# EAGLE board stm32_main_0_2 (EAGLE 5.10), part 1 of 2
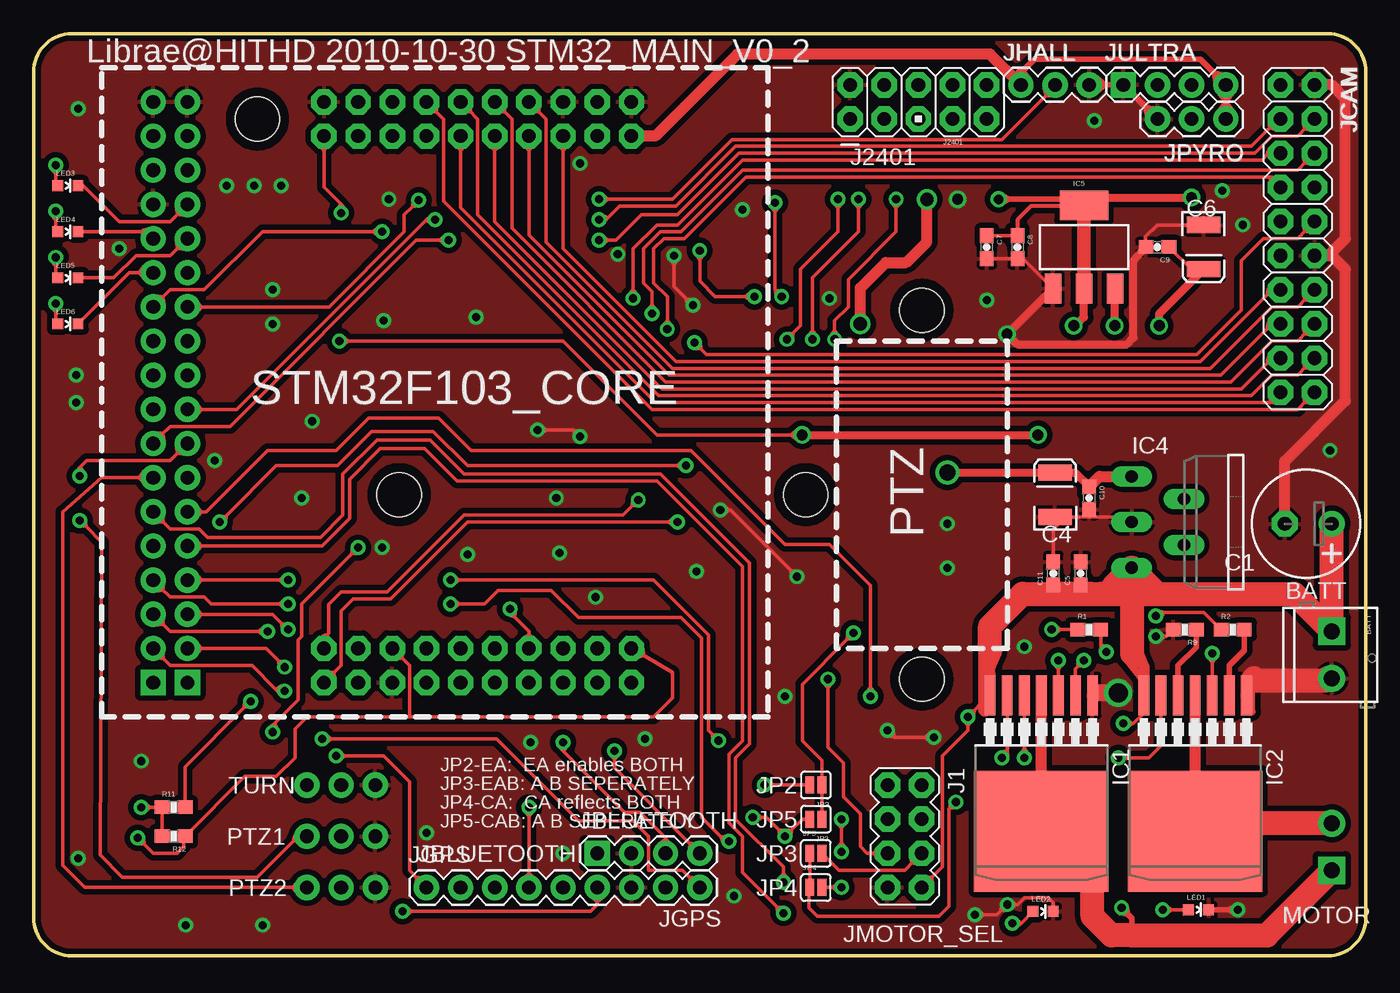
[diagram p1: board, top side]
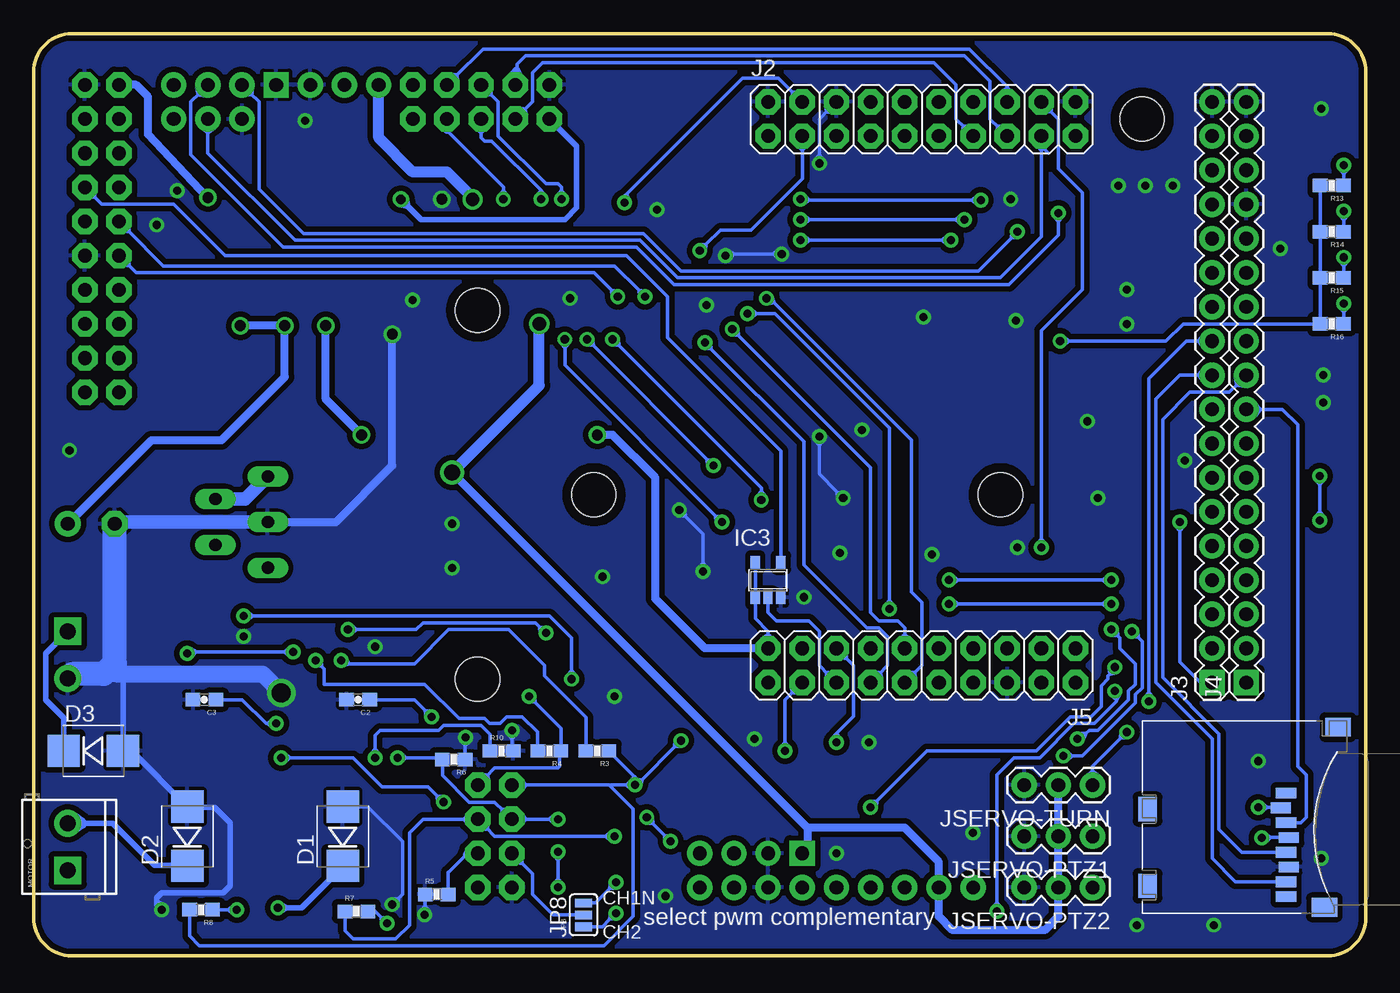
[diagram p2: board, bottom side, seen from below]

Size 99.06 x 68.58 mm. Coordinates in mm from the lower left corner, seen from the top.
Outline: 2.84,68.58 arc90 0,65.74 0,2.84 arc90 2.84,0 96.22,0 arc90 99.06,2.84 99.06,65.74 arc90 96.22,68.58 2.84,68.58
Copper layers (1*16): Top 0.035mm / dielectric 1.5mm / Bottom 0.035mm
Design rules "SparkFun": minimum track width 8mil, minimum drill 20mil, track to track 8mil, track to pad 8mil, pad to pad 8mil, via to via 8mil, smd to smd 8mil, copper to edge 10mil, drill to drill 8mil, minimum pad ring 12mil, minimum via ring 10mil, stop-mask expansion 4mil, vias tented up to drill 25mil, thermal gap 10mil

## Footprints (pad centres in the part's own frame; a part is rotated, then mirrored left to right if it is on the bottom)
SCREWTERMINAL-3.5MM-2 = drill 1.2 pad 2.032 square: 1 0,0 | drill 1.2 pad 2.032 round: 2 3.5,0
E-035X080 = drill 1.016 pad 1.93 round: + -1.905,0 | drill 1.016 pad 1.93 octagon: - 1.587,0
0603-CAP = smd 1.1 x 1: 1 -0.85,0; 2 0.85,0
EIA3528 = smd 1.2 x 2.5: A 1.65,0; C -1.65,0
SMB-DIODE = smd 2.4 x 2.4: A 2.2,0; C -2.2,0
P-TO263-7-1 = smd 0.8 x 3: 1 -3.81,-9.207; 2 -2.54,-9.207; 3 -1.27,-9.207; 4 0,-9.207; 5 1.27,-9.207; 6 2.54,-9.207; 7 3.81,-9.207 | smd 10 x 9: 8 0,0.895
SOT23-5 = smd 0.69 x 0.99: 1 -0.95,-1.29; 2 0,-1.29; 3 0.95,-1.29; 4 0.95,1.3; 5 -0.95,1.3
TO220-5 = drill 0.9 long: 1 -3.4,-8.4; 2 -1.7,-4.5; 3 0,-8.4; 4 1.7,-4.5; 5 3.4,-8.4
SOT223 = smd 1.219 x 2.235: 1 -2.311,-3.099; 2 0,-3.099; 3 2.311,-3.099 | smd 3.6 x 2.2: 4 0,3.099
2X4 = drill 1.016 pad 1.88 octagon: 1 -3.81,-1.27; 2 -3.81,1.27; 3 -1.27,-1.27; 4 -1.27,1.27; 5 1.27,-1.27; 6 1.27,1.27; 7 3.81,-1.27; 8 3.81,1.27
2X10 = drill 1.016 pad 1.88 octagon: 1 -11.43,-1.27; 2 -11.43,1.27; 3 -8.89,-1.27; 4 -8.89,1.27; 5 -6.35,-1.27; 6 -6.35,1.27; 7 -3.81,-1.27; 8 -3.81,1.27; 9 -1.27,-1.27; 10 -1.27,1.27; 11 1.27,-1.27; 12 1.27,1.27; 13 3.81,-1.27; 14 3.81,1.27; 15 6.35,-1.27; 16 6.35,1.27; 17 8.89,-1.27; 18 8.89,1.27; 19 11.43,-1.27; 20 11.43,1.27
1X18 = drill 1.016 pad 1.88 square: 1 0,0 | drill 1.016 pad 1.88 round: 2 2.54,0; 3 5.08,0; 4 7.62,0; 5 10.16,0; 6 12.7,0; 7 15.24,0; 8 17.78,0; 9 20.32,0; 10 22.86,0; 11 25.4,0; 12 27.94,0; 13 30.48,0; 14 33.02,0; 15 35.56,0; 16 38.1,0; 17 40.64,0; 18 43.18,0
AVR_ICSP = drill 1.016 pad 1.88 octagon: 1 -1.27,5.08; 2 1.27,5.08; 3 -1.27,2.54; 4 1.27,2.54; 5 -1.27,0; 6 1.27,0; 7 -1.27,-2.54; 8 1.27,-2.54; 9 -1.27,-5.08; 10 1.27,-5.08
1X04 = drill 1.016 pad 1.88 square: 1 0,0 | drill 1.016 pad 1.88 round: 2 2.54,0; 3 5.08,0; 4 7.62,0
1X09 = drill 1.016 pad 1.88 round: 1 0,0; 2 2.54,0; 3 5.08,0; 4 7.62,0; 5 10.16,0; 6 12.7,0; 7 15.24,0; 8 17.78,0; 9 20.32,0
1X03 = drill 1.016 pad 1.88 round: 1 0,0; 2 2.54,0; 3 5.08,0
STAND-OFF = hole 3.302: 0,0
SJ_2S = smd 0.635 x 1.27: 1 -0.45,0; 2 0.45,0
SJ_3_PASTE2&3 = smd 0.635 x 1.27: 1 -0.889,0; 2 0,0; 3 0.889,0
LED-0603 = smd 0.8 x 0.8: A 0,-0.75; C 0,0.75
0603-RES = smd 1.1 x 1: 1 -0.85,0; 2 0.85,0
MICROSD = smd 0.8 x 1.5: 1 -1.94,2.7; 2 -0.84,2.3; 3 0.26,2.7; 4 1.36,2.9; 5 2.46,2.7; 6 3.56,2.9; 7 4.66,2.7; 8 5.76,2.7 | smd 1.4 x 1.9: NC -6.85,6.55; NC3 6.55,5.55 | smd 1.8 x 1.4: NC1 -0.75,-7.6; NC2 4.95,-7.6

## Placement (x,y rotation side)
BATT  [SCREWTERMINAL-3.5MM-2]  96.52,24.13 270 top
C1  470uF 16V  [E-035X080]  94.61,32.13 180 top
C2  1uF 25V  [0603-CAP]  74.93,19.05 180 bottom
C3  1uF 25V  [0603-CAP]  86.36,19.05 180 bottom
C4  10uF  [EIA3528]  75.95,34.29 90 top
C5  3.3uF  [0603-CAP]  77.85,28.45 90 top
C6  10uF  [EIA3528]  87,52.7 270 top
C7  3.3uF  [0603-CAP]  70.87,52.7 270 top
C8  104  [0603-CAP]  73.15,52.7 270 top
C9  104  [0603-CAP]  83.57,52.7 180 top
C10  104  [0603-CAP]  78.49,34.04 270 top
C11  104  [0603-CAP]  75.82,28.45 90 top
D1  DIODE-ZENERSMB  [SMB-DIODE]  76.07,8.89 90 bottom
D2  DIODE-ZENERSMB  [SMB-DIODE]  87.63,8.89 90 bottom
D3  DIODE-ZENERSMB  [SMB-DIODE]  94.61,15.24 0 bottom
IC1  BTS7960  [P-TO263-7-1]  74.93,10.16 180 top
IC2  BTS7960  [P-TO263-7-1]  86.36,10.16 180 top
IC3  74LVC1G00DBV  [SOT23-5]  44.45,27.94 0 bottom
IC4  [TO220-5]  90.04,32.26 270 top
IC5  [SOT223]  78.11,52.7 0 top
J1  M04X2  [2X4]  64.77,8.89 270 top
J2  M10X2  [2X10]  33.02,62.23 0 bottom
J3  M18_  [1X18]  11.43,20.32 90 bottom
J4  M18_  [1X18]  8.89,20.32 90 bottom
J5  M10X2  [2X10]  33.02,21.59 180 bottom
J2401  M05X2PTH  [AVR_ICSP]  65.79,63.5 90 top
JBLUETOOTH  [1X04]  41.91,7.62 0 top
JCAM  M10X2  [2X10]  93.98,53.34 270 top
JGPS  M09  [1X09]  29.21,5.08 0 top
JHALL  [1X03]  73.41,64.77 0 top
JP1  STAND-OFF  [STAND-OFF]  66.04,48.01 0 top
JP2  [SJ_2S]  58.17,12.7 180 top
JP3  [SJ_2S]  58.17,10.16 180 top
JP4  [SJ_2S]  58.17,5.08 0 top
JP5  [SJ_2S]  58.17,7.62 0 top
JP6  STAND-OFF  [STAND-OFF]  66.04,20.57 0 top
JP7  STAND-OFF  [STAND-OFF]  57.4,34.29 90 top
JP8  JUMPER-32-3  [SJ_3_PASTE2&3]  58.17,3.05 90 bottom
JP9  STAND-OFF  [STAND-OFF]  27.18,34.29 0 top
JP10  STAND-OFF  [STAND-OFF]  16.64,62.23 0 top
JPYRO  [1X03]  88.65,62.23 180 top
JSERVO-PTZ1  [1X03]  20.32,8.89 180 bottom
JSERVO-PTZ2  [1X03]  20.32,5.08 180 bottom
JSERVO-TURN  [1X03]  20.32,12.7 180 bottom
JULTRA  [1X04]  81.03,64.77 0 top
LED1  [LED-0603]  86.61,3.43 270 top
LED2  [LED-0603]  75.06,3.3 270 top
LED3  [LED-0603]  2.54,57.28 270 top
LED4  [LED-0603]  2.54,53.85 270 top
LED5  [LED-0603]  2.54,50.42 270 top
LED6  [LED-0603]  2.54,46.99 270 top
MOTOR  [SCREWTERMINAL-3.5MM-2]  96.52,6.35 90 bottom
R1  10K  [0603-RES]  78.49,24.26 0 top
R2  10K  [0603-RES]  89.15,24.26 0 top
R3  10K  [0603-RES]  57.15,15.24 180 bottom
R4  10K  [0603-RES]  60.71,15.24 180 bottom
R5  634  [0603-RES]  69.09,4.57 0 bottom
R6  634  [0603-RES]  67.82,14.61 180 bottom
R7  220  [0603-RES]  75.06,3.3 0 bottom
R8  220  [0603-RES]  86.61,3.43 180 bottom
R9  1K  [0603-RES]  85.6,24.26 180 top
R10  1K  [0603-RES]  64.26,15.24 0 bottom
R11  0R  [0603-RES]  10.41,11.05 0 top
R12  10K  [0603-RES]  10.41,8.89 180 top
R13  470  [0603-RES]  2.54,57.28 180 bottom
R14  470  [0603-RES]  2.54,53.85 180 bottom
R15  470  [0603-RES]  2.54,50.42 180 bottom
R16  470  [0603-RES]  2.54,46.99 180 bottom
TF-SOCKET  SF-MICROSD  [MICROSD]  8.64,10.16 270 bottom

## Tracks (layer width: path | path; a pad name or v marks a point on that pad's centre or on a via)
3V3  (via drill 0.6, 0.7, 0.8)
  Top 0.254: C8.1 C7.1 | J5.19 45.31,22.38 47.5,21.08 47.5,19.18 46.1,17.78 27.94,17.78 | 27.94,17.78 20.32,17.78 19.43,16.89 19.43,14.73 18.03,13.34 15.71,13.34 R12.1 11.18,8.8 11.18,8.13 10.67,7.62 8.89,7.62 8.21,8.3 | 23.39,45.72 39.37,45.72 46.35,38.73 56.27,38.73 | 23.39,45.72 | 23.39,45.72 v22.73,45.72 | v57.15,38.73 56.27,38.73 | 56.27,38.73 | v7.75,8.76 8.21,8.3 | J5.5 27.28,22.25 27.94,21.59 27.94,17.78 | 56.27,38.73 | 56.83,38.31 56.27,38.73 | v57.15,38.73 56.83,38.31 | 56.83,39.16 56.27,38.73 | v57.15,38.73 56.83,39.16 | 56.83,38.31 56.27,38.73 | v57.15,38.73 56.83,38.31 | 56.83,39.16 56.27,38.73 | v57.15,38.73 56.83,39.16 | 56.27,38.73 56.83,38.31 | v57.15,38.73 56.83,38.31 | 56.27,38.73 56.83,39.16 | v57.15,38.73 56.83,39.16 | 8.21,8.3 8.17,8.8 v7.75,8.76 | 8.21,8.3 7.71,8.34 v7.75,8.76 | 23.39,45.72 23.01,46.05 | 23.01,46.05 v22.73,45.72 | 23.39,45.72 | 23.39,45.72 23.01,45.39 | 23.01,45.39 v22.73,45.72 | 23.39,45.72 23.01,46.05 v22.73,45.72 | 23.39,45.72 23.01,45.39 | v22.73,45.72 23.01,45.39 | 23.39,45.72 23.01,46.05 | 23.01,46.05 v22.73,45.72 | 23.39,45.72 23.01,45.39 | 23.01,45.39 v22.73,45.72
  Top 0.305: C8.1 73.15,54.74 74.17,55.75 78.05,55.75 IC5.4
  Top 0.406: 72.53,56.26 78.87,56.26 78.99,56.39 | 72.53,56.26 | 72.53,56.26 v71.75,56.26 | 72.53,56.26 71.96,56.6 | 71.96,56.6 v71.75,56.26 | 72.53,56.26 | 72.53,56.26 71.96,55.92 | 71.96,55.92 v71.75,56.26 | 72.53,56.26 71.96,56.6 v71.75,56.26 | 72.53,56.26 71.96,55.92 | v71.75,56.26 71.96,55.92 | 72.53,56.26 71.96,56.6 | 71.96,56.6 v71.75,56.26 | 72.53,56.26 71.96,55.92 v71.75,56.26
  Top 0.508: 45.13,22.96 45.2,22.44 44.72,22.23 J5.19 45.13,22.96 | 27.28,22.25 27.35,22.77 J5.5 26.76,22.18 27.28,22.25
  Top 0.61: 78.11,56.39 78.99,56.39 v86.11,56.39 | v57.15,38.73 v74.68,38.73 | v77.34,46.86 78.11,47.5 78.11,50.16
  Top 0.813: IC5.4 78.11,56.39
  Top 1.016: IC5.4 78.11,50.16 IC5.2
  Bottom 0.254: v22.73,45.72 22.07,45.72 | 22.07,45.72 | 22.07,45.72 14.86,45.72 13.59,46.99 R16.2 R15.2 R14.2 R13.2 | 44.51,22.93 J5.19 44.45,23.72 44.45,24.13 45.4,25.08 IC3.1 IC3.5 | TF-SOCKET.4 7.09,8.8 | 7.09,8.8 7.71,8.8 v7.75,8.76 | 7.09,8.8 7.45,8.45 v7.75,8.76 | 7.09,8.8 7.49,9.1 v7.75,8.76 | 22.07,45.72 | 22.46,45.39 22.07,45.72 | v22.73,45.72 22.46,45.39 | 22.46,46.05 22.07,45.72 | v22.73,45.72 22.46,46.05 | 22.46,45.39 22.07,45.72 | v22.73,45.72 22.46,45.39 | 22.46,46.05 22.07,45.72 | v22.73,45.72 22.46,46.05 | 22.07,45.72 22.46,45.39 | v22.73,45.72 22.46,45.39 | 22.07,45.72 22.46,46.05 v22.73,45.72
  Bottom 0.406: v71.75,56.26 71.21,55.72 | 71.21,55.72 70.23,54.74 59.56,54.74 58.67,55.63 58.67,60.2 J2401.1 | 71.21,55.72 71.85,55.87 v71.75,56.26 | 71.21,55.72 71.36,56.35 v71.75,56.26
  Bottom 0.508: 44.45,23.72 44.03,23.41 J5.19 44.87,23.41 44.45,23.72
  Bottom 0.61: v86.11,56.39 90.55,61.09 90.55,63.88 91.44,64.77 JCAM.1 | J5.19 49.15,22.86 52.83,26.54 52.83,35.56 56.01,38.73 v57.15,38.73 | v74.68,38.73 77.34,41.4 v77.34,46.86
5V  (via drill 1, 1.2)
  Top 0.406: C4.A | JPYRO.1 88.65,63.09 88.65,63.91 JULTRA.4 88.03,65.38 86.74,66.67 74.42,66.67 73.41,65.66 73.41,65.63 JHALL.1
  Top 0.61: C4.A 77.43,35.94 C10.1 | v67.94,35.94 C4.A
  Top 0.813: IC4.1 79.26,35.66 C10.1 | J2.1 46.23,60.96 52.32,67.06 71.12,67.06 JHALL.1 | v61.47,46.99 61.47,49.66 63.37,51.56 64.9,51.56 66.42,53.09 v66.42,56.26 | JULTRA.4 89.06,64.44 88.65,63.91 88.23,64.44 JULTRA.4 | JULTRA.4 88.12,64.71 88.03,65.38 88.71,65.3 JULTRA.4 | JHALL.1 72.99,65.1 73.41,65.63 73.83,65.1 JHALL.1 | 88.65,63.09 88.23,62.56 JPYRO.1 89.06,62.56 88.65,63.09
  Bottom 0.61: 41.53,9.53 34.29,9.53 31.75,6.99 JGPS.2 31.75,2.92 30.73,1.91 23.88,1.91 22.86,2.92 JSERVO-PTZ2.2 JSERVO-PTZ1.2 JSERVO-TURN.2 | 41.53,9.53 v67.94,35.94 | JBLUETOOTH.1 41.53,8 41.53,9.53
  Bottom 0.813: v67.94,35.94 61.47,42.42 v61.47,46.99 | v66.42,56.26 66.42,56.39 68.33,58.29 70.87,58.29 73.41,60.83 JHALL.1
  Bottom 1.016: IC4.2 83.34,33.96 IC4.1
2401_CE
  Bottom 0.254: J2.13 29.82,61.57 30.48,62.23 30.48,64.77 32.13,66.42 61.21,66.42 61.98,65.66 61.98,63.5 62.63,62.84 J2401.3
  Bottom 0.508: 62.63,62.84 62.57,62.32 J2401.3 63.16,62.91 62.63,62.84 | 29.82,61.57 29.3,61.64 J2.13 29.89,61.05 29.82,61.57
2401_CSN
  Bottom 0.254: J2.15 27.28,61.57 27.94,62.23 27.94,65.02 29.84,66.93 62.48,66.93 63.12,66.29 63.12,64.9 J2401.4 63.14,65.89
  Bottom 0.508: 63.14,65.89 62.69,64.99 J2401.4 63.79,65.2 63.14,65.89 | 27.28,61.57 26.76,61.64 J2.15 27.35,61.05 27.28,61.57
2401_IRQ
  Bottom 0.254: J2401.8 67.72,65.38 65.66,67.44 29.46,67.44 26.67,64.64 26.67,64.36 J2.16
  Bottom 0.508: 67.72,65.38 67.65,64.86 J2401.8 68.24,65.45 67.72,65.38 | 26.67,64.36 26.25,64.05 J2.16 27.09,64.05 26.67,64.36
2401_MISO  (via drill 0.6)
  Top 0.254: 64.14,55.6 64.14,53.85 60.58,50.29 60.58,48.26 59.56,47.24 59.56,46.51 | 64.14,55.6 | 64.14,55.6 v64.14,56.26 | v59.56,45.85 59.56,46.51 | 59.56,46.51 | 47.22,32.26 32.26,32.26 26.54,26.54 23.75,26.54 22.86,25.65 22.86,21.59 22.2,20.93 J5.2 | 47.22,32.26 | 47.22,32.26 v47.88,32.26 | 64.14,55.6 64.46,55.98 | 64.46,55.98 v64.14,56.26 | 64.14,55.6 | 64.14,55.6 63.81,55.98 | 63.81,55.98 v64.14,56.26 | 64.14,55.6 64.46,55.98 v64.14,56.26 | 64.14,55.6 63.81,55.98 | v64.14,56.26 63.81,55.98 | 64.14,55.6 64.46,55.98 | 64.46,55.98 v64.14,56.26 | 64.14,55.6 63.81,55.98 | 63.81,55.98 v64.14,56.26 | 59.56,46.51 | 59.24,46.12 59.56,46.51 | v59.56,45.85 59.24,46.12 | 59.89,46.12 59.56,46.51 | v59.56,45.85 59.89,46.12 | 59.24,46.12 59.56,46.51 | v59.56,45.85 59.24,46.12 | 59.89,46.12 59.56,46.51 | v59.56,45.85 59.89,46.12 | 59.56,46.51 59.24,46.12 | v59.56,45.85 59.24,46.12 | 59.56,46.51 59.89,46.12 | v59.56,45.85 59.89,46.12 | 47.22,32.26 | 47.22,32.26 47.6,31.93 | v47.88,32.26 47.6,31.93 | 47.22,32.26 47.6,32.58 | 47.6,32.58 v47.88,32.26 | 47.22,32.26 47.6,31.93 | v47.88,32.26 47.6,31.93 | 47.22,32.26 47.6,32.58 | v47.88,32.26 47.6,32.58 | 47.22,32.26 47.6,31.93 | v47.88,32.26 47.6,31.93 | 47.22,32.26 47.6,32.58 | v47.88,32.26 47.6,32.58
  Top 0.508: 22.2,20.93 21.68,21 J5.2 22.27,20.41 22.2,20.93
  Bottom 0.254: J2401.7 68.33,61.37 65.91,58.93 64.14,57.15 64.14,56.92 | v64.14,56.26 64.14,56.92 | 64.14,56.92 | 59.56,45.19 59.56,43.94 48.35,32.73 | 59.56,45.19 | 59.56,45.19 v59.56,45.85 | v47.88,32.26 48.35,32.73 | 64.14,56.92 | 63.81,56.54 64.14,56.92 | v64.14,56.26 63.81,56.54 | 64.46,56.54 64.14,56.92 | v64.14,56.26 64.46,56.54 | 63.81,56.54 64.14,56.92 | v64.14,56.26 63.81,56.54 | 64.46,56.54 64.14,56.92 | v64.14,56.26 64.46,56.54 | 64.14,56.92 63.81,56.54 | v64.14,56.26 63.81,56.54 | 64.14,56.92 64.46,56.54 v64.14,56.26 | 59.56,45.19 59.89,45.57 | 59.89,45.57 v59.56,45.85 | 59.56,45.19 | 59.56,45.19 59.24,45.57 | 59.24,45.57 v59.56,45.85 | 59.56,45.19 59.89,45.57 | v59.56,45.85 59.89,45.57 | 59.56,45.19 59.24,45.57 | v59.56,45.85 59.24,45.57 | 59.56,45.19 59.89,45.57 | 59.89,45.57 v59.56,45.85 | 59.56,45.19 59.24,45.57 | 59.24,45.57 v59.56,45.85 | 48.35,32.73 47.84,32.68 v47.88,32.26 | 48.35,32.73 48.3,32.22 v47.88,32.26
  Bottom 0.508: 68.33,61.37 68.74,61.69 | 68.74,61.69 | 68.33,61.37 67.91,61.69 | 67.91,61.69 | 68.74,61.69 68.33,61.37 | 68.74,61.69 | J2401.7 68.74,61.69 | 67.91,61.69 68.33,61.37 | J2401.7 67.91,61.69 | 68.74,61.69 68.33,61.37 | J2401.7 68.74,61.69 | 67.91,61.69 68.33,61.37 | J2401.7 67.91,61.69
2401_MOSI  (via drill 0.6)
  Top 0.254: 59.82,55.6 59.82,53.85 57.02,51.05 57.02,46.86 56.47,46.31 | 59.82,55.6 | 59.82,55.6 v59.82,56.26 | v56.01,45.85 56.47,46.31 | 44.49,33.44 43.81,32.77 32,32.77 26.29,27.05 22.86,27.05 21.94,26.13 21.94,23.97 21.69,23.72 21.59,23.62 J5.1 | 44.49,33.44 v44.96,33.91 | 59.82,55.6 60.14,55.98 | 60.14,55.98 v59.82,56.26 | 59.82,55.6 | 59.82,55.6 59.49,55.98 | 59.49,55.98 v59.82,56.26 | 59.82,55.6 60.14,55.98 v59.82,56.26 | 59.82,55.6 59.49,55.98 | v59.82,56.26 59.49,55.98 | 59.82,55.6 60.14,55.98 | 60.14,55.98 v59.82,56.26 | 59.82,55.6 59.49,55.98 | 59.49,55.98 v59.82,56.26 | 56.47,46.31 55.97,46.27 v56.01,45.85 | 56.47,46.31 56.43,45.81 v56.01,45.85 | 44.49,33.44 44.99,33.48 v44.96,33.91 | 44.49,33.44 44.53,33.94 v44.96,33.91
  Top 0.508: 21.24,23.45 21.69,23.72 22.07,23.36 J5.1 21.24,23.45
  Bottom 0.254: J2401.6 65.17,64.16 64.52,63.5 64.52,60.96 60.96,57.4 60.07,57.4 59.82,57.15 59.82,56.92 | v59.82,56.26 59.82,56.92 | 59.82,56.92 | v44.96,33.91 44.96,34.57 | 44.96,34.57 | 44.96,34.57 44.96,34.8 55.54,45.38 | 55.54,45.38 v56.01,45.85 | 59.82,56.92 | 59.49,56.54 59.82,56.92 | v59.82,56.26 59.49,56.54 | 60.14,56.54 59.82,56.92 | v59.82,56.26 60.14,56.54 | 59.49,56.54 59.82,56.92 | v59.82,56.26 59.49,56.54 | 60.14,56.54 59.82,56.92 | v59.82,56.26 60.14,56.54 | 59.82,56.92 59.49,56.54 | v59.82,56.26 59.49,56.54 | 59.82,56.92 60.14,56.54 v59.82,56.26 | 55.54,45.38 56.04,45.42 v56.01,45.85 | 55.54,45.38 55.58,45.88 v56.01,45.85 | 44.96,34.57 | 44.63,34.19 44.96,34.57 | v44.96,33.91 44.63,34.19 | 45.28,34.19 44.96,34.57 | v44.96,33.91 45.28,34.19 | 44.63,34.19 44.96,34.57 | v44.96,33.91 44.63,34.19 | 45.28,34.19 44.96,34.57 | v44.96,33.91 45.28,34.19 | 44.96,34.57 44.63,34.19 | v44.96,33.91 44.63,34.19 | 44.96,34.57 45.28,34.19 v44.96,33.91
  Bottom 0.508: 65.17,64.16 65.69,64.09 J2401.6 65.11,64.68 65.17,64.16
2401_SCK  (via drill 0.6)
  Top 0.254: 61.34,55.6 61.34,53.85 57.91,50.42 57.91,46.51 | 61.34,55.6 | 61.34,55.6 v61.34,56.26 | v57.91,45.85 57.91,46.51 | 57.91,46.51 | v13.84,32.26 14.31,32.73 | 14.31,32.73 18.03,36.45 22.61,36.45 25.15,38.99 29.72,38.99 32.26,36.45 47.85,36.45 | 47.85,36.45 | 47.85,36.45 v48.51,36.45 | 61.34,55.6 61.67,55.98 | 61.67,55.98 v61.34,56.26 | 61.34,55.6 | 61.34,55.6 61.02,55.98 | 61.02,55.98 v61.34,56.26 | 61.34,55.6 61.67,55.98 v61.34,56.26 | 61.34,55.6 61.02,55.98 | v61.34,56.26 61.02,55.98 | 61.34,55.6 61.67,55.98 | 61.67,55.98 v61.34,56.26 | 61.34,55.6 61.02,55.98 | 61.02,55.98 v61.34,56.26 | 57.91,46.51 | 57.59,46.12 57.91,46.51 | v57.91,45.85 57.59,46.12 | 58.24,46.12 57.91,46.51 | v57.91,45.85 58.24,46.12 | 57.59,46.12 57.91,46.51 | v57.91,45.85 57.59,46.12 | 58.24,46.12 57.91,46.51 | v57.91,45.85 58.24,46.12 | 57.91,46.51 57.59,46.12 | v57.91,45.85 57.59,46.12 | 57.91,46.51 58.24,46.12 v57.91,45.85 | 47.85,36.45 | 47.85,36.45 48.24,36.12 | v48.51,36.45 48.24,36.12 | 47.85,36.45 48.24,36.77 | 48.24,36.77 v48.51,36.45 | 47.85,36.45 48.24,36.12 | v48.51,36.45 48.24,36.12 | 47.85,36.45 48.24,36.77 | v48.51,36.45 48.24,36.77 | 47.85,36.45 48.24,36.12 | v48.51,36.45 48.24,36.12 | 47.85,36.45 48.24,36.77 | v48.51,36.45 48.24,36.77 | 14.31,32.73 13.81,32.68 v13.84,32.26 | 14.31,32.73 14.27,32.22 v13.84,32.26
  Bottom 0.254: J2401.5 65.79,61.37 65.79,60.83 65.53,60.58 65,60.58 61.34,56.92 | v61.34,56.26 61.34,56.92 | 61.34,56.92 | v48.51,36.45 48.98,36.92 | 48.98,36.92 57.45,45.38 | 57.45,45.38 v57.91,45.85 | 13.84,31.6 13.84,21.84 12.32,20.32 J3.1 | 13.84,31.6 | 13.84,31.6 v13.84,32.26 | 61.34,56.92 | 61.02,56.54 61.34,56.92 | v61.34,56.26 61.02,56.54 | 61.67,56.54 61.34,56.92 | v61.34,56.26 61.67,56.54 | 61.02,56.54 61.34,56.92 | v61.34,56.26 61.02,56.54 | 61.67,56.54 61.34,56.92 | v61.34,56.26 61.67,56.54 | 61.34,56.92 61.02,56.54 | v61.34,56.26 61.02,56.54 | 61.34,56.92 61.67,56.54 v61.34,56.26 | 57.45,45.38 57.95,45.42 v57.91,45.85 | 57.45,45.38 57.49,45.88 v57.91,45.85 | 48.98,36.92 48.48,36.87 v48.51,36.45 | 48.98,36.92 48.94,36.41 v48.51,36.45 | 13.84,31.6 14.17,31.98 | 14.17,31.98 v13.84,32.26 | 13.84,31.6 | 13.84,31.6 13.52,31.98 | 13.52,31.98 v13.84,32.26 | 13.84,31.6 14.17,31.98 v13.84,32.26 | 13.84,31.6 13.52,31.98 | v13.84,32.26 13.52,31.98 | 13.84,31.6 14.17,31.98 | 14.17,31.98 v13.84,32.26 | 13.84,31.6 13.52,31.98 | 13.52,31.98 v13.84,32.26
  Bottom 0.508: 65.79,61.37 66.2,61.69 | 66.2,61.69 | 65.79,61.37 65.37,61.69 | 65.37,61.69 | 66.2,61.69 65.79,61.37 | 66.2,61.69 | J2401.5 66.2,61.69 | 65.37,61.69 65.79,61.37 | J2401.5 65.37,61.69 | 66.2,61.69 65.79,61.37 | J2401.5 66.2,61.69 | 65.37,61.69 65.79,61.37 | J2401.5 65.37,61.69
CURR-A  (via drill 0.6)
  Top 0.254: v72.01,14.73 72.39,15.11 72.39,15.27 | 72.39,15.27 IC1.6 | 59.41,5.08 JP4.2 | 59.41,5.08 | 59.41,5.08 v60.07,5.08 | v60.07,7.75 60.07,8.41 | 60.07,8.41 | 60.07,8.41 60.07,9.5 | 60.07,9.5 | 60.07,9.5 v60.07,10.16 | 72.39,15.27 71.9,15.15 v72.01,14.73 | 72.39,15.27 72.43,14.77 v72.01,14.73 | 59.41,5.08 | 59.8,4.75 59.41,5.08 | v60.07,5.08 59.8,4.75 | 59.8,5.41 59.41,5.08 | v60.07,5.08 59.8,5.41 | 59.8,4.75 59.41,5.08 | v60.07,5.08 59.8,4.75 | 59.8,5.41 59.41,5.08 | v60.07,5.08 59.8,5.41 | 59.8,4.75 59.41,5.08 | 59.8,4.75 v60.07,5.08 | 59.41,5.08 59.8,5.41 v60.07,5.08 | 60.07,8.41 | 59.74,8.02 60.07,8.41 | v60.07,7.75 59.74,8.02 | 60.4,8.02 60.07,8.41 | v60.07,7.75 60.4,8.02 | 59.74,8.02 60.07,8.41 | v60.07,7.75 59.74,8.02 | 60.4,8.02 60.07,8.41 | v60.07,7.75 60.4,8.02 | 60.07,8.41 59.74,8.02 | v60.07,7.75 59.74,8.02 | 60.07,8.41 60.4,8.02 | v60.07,7.75 60.4,8.02 | 60.07,9.5 60.4,9.88 | 60.4,9.88 v60.07,10.16 | 60.07,9.5 | 60.07,9.5 59.74,9.88 | 59.74,9.88 v60.07,10.16 | 60.07,9.5 60.4,9.88 | v60.07,10.16 60.4,9.88 | 60.07,9.5 59.74,9.88 | v60.07,10.16 59.74,9.88 | 60.07,9.5 60.4,9.88 | 60.4,9.88 v60.07,10.16 | 60.07,9.5 59.74,9.88 | 59.74,9.88 v60.07,10.16
  Bottom 0.254: 71.35,14.73 69.18,14.73 R6.2 68.67,13.42 66.67,11.43 64.77,11.43 64.11,10.77 J1.3 62.64,10.16 60.73,10.16 | 71.35,14.73 | 71.35,14.73 v72.01,14.73 | v60.07,5.08 60.07,5.74 | 60.07,5.74 | 60.07,5.74 60.07,7.09 | 60.07,7.09 | 60.07,7.09 v60.07,7.75 | v60.07,10.16 60.73,10.16 | 60.73,10.16 | 71.35,14.73 | 71.35,14.73 71.73,14.41 | v72.01,14.73 71.73,14.41 | 71.35,14.73 71.73,15.06 | 71.73,15.06 v72.01,14.73 | 71.35,14.73 71.73,14.41 | v72.01,14.73 71.73,14.41 | 71.35,14.73 71.73,15.06 | v72.01,14.73 71.73,15.06 | 71.35,14.73 71.73,14.41 | v72.01,14.73 71.73,14.41 | 71.35,14.73 71.73,15.06 v72.01,14.73 | 60.07,5.74 | 59.74,5.36 60.07,5.74 | v60.07,5.08 59.74,5.36 | 60.4,5.36 60.07,5.74 | v60.07,5.08 60.4,5.36 | 59.74,5.36 60.07,5.74 | v60.07,5.08 59.74,5.36 | 60.4,5.36 60.07,5.74 | v60.07,5.08 60.4,5.36 | 60.07,5.74 59.74,5.36 | v60.07,5.08 59.74,5.36 | 60.07,5.74 60.4,5.36 | v60.07,5.08 60.4,5.36 | 60.07,7.09 60.4,7.47 | 60.4,7.47 v60.07,7.75 | 60.07,7.09 | 60.07,7.09 59.74,7.47 | 59.74,7.47 v60.07,7.75 | 60.07,7.09 60.4,7.47 | v60.07,7.75 60.4,7.47 | 60.07,7.09 59.74,7.47 | v60.07,7.75 59.74,7.47 | 60.07,7.09 60.4,7.47 | 60.4,7.47 v60.07,7.75 | 60.07,7.09 59.74,7.47 | 59.74,7.47 v60.07,7.75 | 60.35,10.49 60.73,10.16 | v60.07,10.16 60.35,10.49 | 60.73,10.16 | 60.35,9.83 60.73,10.16 | v60.07,10.16 60.35,9.83 | 60.73,10.16 60.35,10.49 | v60.07,10.16 60.35,10.49 | 60.73,10.16 60.35,9.83 | v60.07,10.16 60.35,9.83 | 60.35,10.49 60.73,10.16 | v60.07,10.16 60.35,10.49 | 60.35,9.83 60.73,10.16 | v60.07,10.16 60.35,9.83
  Bottom 0.508: 62.64,10.16 62.95,9.74 | 62.95,9.74 | 62.64,10.16 62.95,10.58 | 62.95,10.58 | J1.3 63.59,10.84 64.11,10.77 64.18,10.25 J1.3 | 62.95,9.74 62.64,10.16 | 62.95,9.74 | J1.3 62.95,9.74 | 62.95,10.58 62.64,10.16 | J1.3 62.95,10.58 | 62.95,9.74 62.64,10.16 | J1.3 62.95,9.74 | 62.95,10.58 62.64,10.16 | J1.3 62.95,10.58
CURR-B
  Top 0.254: JP5.2 59.89,6.35 64.77,6.35 65.43,7.01 J1.6
  Top 0.508: 65.43,7.01 65.95,6.94 J1.6 65.36,7.53 65.43,7.01
  Bottom 0.254: J1.6 66.8,7.62 66.9,7.52 68.2,6.22 68.24,6.22 R5.2
  Bottom 0.508: 66.9,7.52 | 66.9,7.52 | 66.53,7.14 66.9,7.52 | J1.6 66.53,7.14 | 66.63,7.97 66.9,7.52 | 66.63,7.97 | J1.6 66.63,7.97 | 66.53,7.14 66.9,7.52 | J1.6 66.53,7.14 | 66.63,7.97 66.9,7.52 | J1.6 66.63,7.97 | 66.53,7.14 66.9,7.52 | J1.6 66.53,7.14
D0
  Top 0.254: JCAM.13 92.08,49.53 91.87,49.33 86.74,44.2 47.75,44.2 39.37,52.58 39.37,60.1 J2.5
  Top 0.508: 91.87,49.33 | 91.87,49.33 92.28,49 | 92.28,49 JCAM.13 | 91.87,49.33 | 91.87,49.33 92.08,49.81 | 92.08,49.81 | 91.87,49.33 92.28,49 | 92.28,49 | JCAM.13 92.28,49 | 91.87,49.33 92.08,49.81 | 92.08,49.81 JCAM.13 | 91.87,49.33 92.28,49 | 92.28,49 JCAM.13 | 91.87,49.33 92.08,49.81 | 92.08,49.81 JCAM.13 | 39.37,60.1 39.79,60.41 J2.5 38.95,60.41 39.37,60.1
D1
  Top 0.254: JCAM.14 94.64,48.92 93.98,48.26 92.08,48.26 87.5,43.69 47.5,43.69 38.1,53.09 38.1,62.23 37.44,62.89 J2.8
  Top 0.508: 94.64,48.92 95.16,48.85 JCAM.14 94.57,49.44 94.64,48.92 | 37.44,62.89 37.51,63.41 J2.8 36.92,62.82 37.44,62.89
D2
  Top 0.254: JCAM.15 92.08,46.99 91.87,46.79 88.27,43.18 47.24,43.18 36.83,53.59 36.83,60.1 J2.7
  Top 0.508: 91.87,46.79 | 91.87,46.79 92.28,46.46 | 92.28,46.46 JCAM.15 | 91.87,46.79 | 91.87,46.79 92.08,47.27 | 92.08,47.27 | 91.87,46.79 92.28,46.46 | 92.28,46.46 | JCAM.15 92.28,46.46 | 91.87,46.79 92.08,47.27 | 92.08,47.27 JCAM.15 | 91.87,46.79 92.28,46.46 | 92.28,46.46 JCAM.15 | 91.87,46.79 92.08,47.27 | 92.08,47.27 JCAM.15 | 36.83,60.1 37.25,60.41 J2.7 36.41,60.41 36.83,60.1
D3
  Top 0.254: JCAM.16 94.64,46.38 93.98,45.72 92.08,45.72 89.03,42.67 46.99,42.67 35.56,54.1 35.56,62.23 34.9,62.89 J2.10
  Top 0.508: 94.64,46.38 95.16,46.31 JCAM.16 94.57,46.9 94.64,46.38 | 34.9,62.89 34.97,63.41 J2.10 34.38,62.82 34.9,62.89
D4
  Top 0.254: JCAM.17 92.08,44.45 91.87,44.25 89.79,42.16 46.74,42.16 34.29,54.61 34.29,60.1 J2.9
  Top 0.508: 91.87,44.25 | 91.87,44.25 92.28,43.92 | 92.28,43.92 JCAM.17 | 91.87,44.25 | 91.87,44.25 92.08,44.73 | 92.08,44.73 | 91.87,44.25 92.28,43.92 | 92.28,43.92 | JCAM.17 92.28,43.92 | 91.87,44.25 92.08,44.73 | 92.08,44.73 JCAM.17 | 91.87,44.25 92.28,43.92 | 92.28,43.92 JCAM.17 | 91.87,44.25 92.08,44.73 | 92.08,44.73 JCAM.17 | 34.29,60.1 34.71,60.41 J2.9 33.87,60.41 34.29,60.1
D5
  Top 0.254: JCAM.18 94.64,43.84 93.98,43.18 92.08,43.18 90.55,41.66 46.48,41.66 33.02,55.12 33.02,62.23 32.36,62.89 J2.12
  Top 0.508: 94.64,43.84 95.16,43.77 JCAM.18 94.57,44.36 94.64,43.84 | 32.36,62.89 32.43,63.41 J2.12 31.84,62.82 32.36,62.89
D6
  Top 0.254: JCAM.19 92.1,41.3 91.95,41.15 46.23,41.15 31.75,55.63 31.75,60.1 J2.11
  Top 0.508: 92.1,41.3 92.62,41.23 JCAM.19 92.03,41.82 92.1,41.3 | 31.75,60.1 32.17,60.41 J2.11 31.33,60.41 31.75,60.1
D7
  Top 0.254: JCAM.20 94.64,41.3 93.98,40.64 45.97,40.64 30.48,56.13 30.48,62.23 29.82,62.89 J2.14
  Top 0.508: 94.64,41.3 95.16,41.23 JCAM.20 94.57,41.82 94.64,41.3 | 29.82,62.89 29.89,63.41 J2.14 29.3,62.82 29.82,62.89
ECHO  (via drill 0.6)
  Top 0.254: 25.25,53.85 17.02,53.85 12.7,49.53 10.16,49.53 9.5,48.87 J4.12 | 25.25,53.85 | 25.25,53.85 v25.91,53.85 | 25.25,53.85 | 25.25,53.85 25.63,53.52 | v25.91,53.85 25.63,53.52 | 25.25,53.85 25.63,54.17 | 25.63,54.17 v25.91,53.85 | 25.25,53.85 25.63,53.52 | v25.91,53.85 25.63,53.52 | 25.25,53.85 25.63,54.17 | v25.91,53.85 25.63,54.17 | 25.25,53.85 25.63,53.52 | v25.91,53.85 25.63,53.52 | 25.25,53.85 25.63,54.17 v25.91,53.85
  Top 0.508: 9.5,48.87 8.98,48.94 J4.12 9.57,48.35 9.5,48.87
  Bottom 0.254: JULTRA.2 82.95,64.16 82.3,63.5 82.3,57.02 78.99,53.72 53.72,53.72 50.93,50.93 28.83,50.93 26.38,53.38 | v25.91,53.85 26.38,53.38 | 26.38,53.38 26.33,53.88 v25.91,53.85 | 26.38,53.38 25.87,53.42 v25.91,53.85
  Bottom 0.508: 82.95,64.16 83.47,64.09 JULTRA.2 82.89,64.68 82.95,64.16
EN-A  (via drill 0.6)
  Top 0.254: v54.36,12.7 55.02,12.7 | 55.02,12.7 | 55.02,12.7 JP2.2 | J3.4 12.29,27.94 18.26,27.94 | 18.26,27.94 | 18.26,27.94 v18.92,27.94 | v30.99,27.94 31.65,27.94 | 31.65,27.94 | 31.65,27.94 46.1,27.94 50.16,23.88 50.16,16.76 50.46,16.47 | 50.46,16.47 v50.93,16 | 54.63,13.03 55.02,12.7 | v54.36,12.7 54.63,13.03 | 55.02,12.7 | 54.63,12.37 55.02,12.7 | v54.36,12.7 54.63,12.37 | 55.02,12.7 54.63,13.03 v54.36,12.7 | 55.02,12.7 54.63,12.37 | v54.36,12.7 54.63,12.37 | 54.63,13.03 55.02,12.7 | v54.36,12.7 54.63,13.03 | 54.63,12.37 55.02,12.7 | v54.36,12.7 54.63,12.37 | 18.26,27.94 | 18.26,27.94 18.65,27.61 | v18.92,27.94 18.65,27.61 | 18.26,27.94 18.65,28.27 | 18.65,28.27 v18.92,27.94 | 18.26,27.94 18.65,27.61 | v18.92,27.94 18.65,27.61 | 18.26,27.94 18.65,28.27 | v18.92,27.94 18.65,28.27 | 18.26,27.94 18.65,27.61 | v18.92,27.94 18.65,27.61 | 18.26,27.94 18.65,28.27 v18.92,27.94 | 31.26,28.27 31.65,27.94 | v30.99,27.94 31.26,28.27 | 31.65,27.94 | 31.26,27.61 31.65,27.94 | v30.99,27.94 31.26,27.61 | 31.65,27.94 31.26,28.27 v30.99,27.94 | 31.65,27.94 31.26,27.61 | v30.99,27.94 31.26,27.61 | 31.26,28.27 31.65,27.94 | v30.99,27.94 31.26,28.27 | 31.26,27.61 31.65,27.94 | v30.99,27.94 31.26,27.61 | 50.46,16.47 50.5,15.97 v50.93,16 | 50.46,16.47 50.96,16.43 v50.93,16
  Top 0.508: 12.29,27.94 11.97,28.36 J3.4 11.97,27.52 12.29,27.94
  Bottom 0.254: R8.2 87.46,1.49 86.74,0.76 56.64,0.76 54.48,2.92 54.48,10.92 56.2,12.64 | 56.2,12.64 56.26,12.7 62.64,12.7 J1.1 | v54.36,12.7 55.02,12.7 | 55.02,12.7 | 55.02,12.7 56.13,12.7 56.2,12.64 | 54.42,13.36 54.36,13.3 v54.36,12.7 | 54.42,13.36 R3.1 | v18.92,27.94 19.58,27.94 | 19.58,27.94 | 19.58,27.94 30.33,27.94 | 30.33,27.94 | 30.33,27.94 v30.99,27.94 | v50.93,16 51.39,15.54 | 51.39,15.54 53.83,13.1 | 53.83,13.1 54.23,12.7 v54.36,12.7 | 54.63,13.03 55.02,12.7 | v54.36,12.7 54.63,13.03 | 55.02,12.7 | 54.63,12.37 55.02,12.7 | v54.36,12.7 54.63,12.37 | 55.02,12.7 54.63,13.03 v54.36,12.7 | 55.02,12.7 54.63,12.37 | v54.36,12.7 54.63,12.37 | 54.63,13.03 55.02,12.7 | v54.36,12.7 54.63,13.03 | 54.63,12.37 55.02,12.7 | v54.36,12.7 54.63,12.37 | 54.42,13.36 54.06,13.01 v54.36,12.7 | 54.42,13.36 54.71,12.95 v54.36,12.7 | 53.83,13.1 53.94,12.61 v54.36,12.7 | 53.83,13.1 54.33,13.13 v54.36,12.7 | 19.2,28.27 19.58,27.94 | v18.92,27.94 19.2,28.27 | 19.58,27.94 | 19.2,27.61 19.58,27.94 | v18.92,27.94 19.2,27.61 | 19.58,27.94 19.2,28.27 v18.92,27.94 | 19.58,27.94 19.2,27.61 | v18.92,27.94 19.2,27.61 | 19.2,28.27 19.58,27.94 | v18.92,27.94 19.2,28.27 | 19.2,27.61 19.58,27.94 | v18.92,27.94 19.2,27.61 | 30.33,27.94 | 30.33,27.94 30.71,27.61 | v30.99,27.94 30.71,27.61 | 30.33,27.94 30.71,28.27 | 30.71,28.27 v30.99,27.94 | 30.33,27.94 30.71,27.61 | v30.99,27.94 30.71,27.61 | 30.33,27.94 30.71,28.27 | v30.99,27.94 30.71,28.27 | 30.33,27.94 30.71,27.61 | v30.99,27.94 30.71,27.61 | 30.33,27.94 30.71,28.27 v30.99,27.94 | 51.39,15.54 51.35,16.04 v50.93,16 | 51.39,15.54 50.89,15.58 v50.93,16
  Bottom 0.508: 62.64,12.7 62.95,12.28 | 62.95,12.28 | 62.64,12.7 62.95,13.12 | 62.95,13.12 | 62.95,12.28 62.64,12.7 | 62.95,12.28 | J1.1 62.95,12.28 | 62.95,13.12 62.64,12.7 | J1.1 62.95,13.12 | 62.95,12.28 62.64,12.7 | J1.1 62.95,12.28 | 62.95,13.12 62.64,12.7 | J1.1 62.95,13.12
EN-B  (via drill 0.6)
  Top 0.254: v55.88,8.89 56.35,9.36 | 56.35,9.36 57.15,10.16 JP3.2 | J4.4 9.5,27.33 10.16,26.67 12.7,26.67 13.21,26.16 18.26,26.16 | 18.26,26.16 | 18.26,26.16 v18.92,26.16 | v30.99,26.16 31.65,26.16 | 31.65,26.16 | 31.65,26.16 33.53,26.16 34.54,27.18 38.48,27.18 40.51,25.15 48.13,25.15 49.66,23.62 49.66,10.29 51.11,8.83 | 51.11,8.83 51.44,8.51 v51.69,8.51 | v53.47,10.29 54.13,10.29 | 54.13,10.29 | 54.13,10.29 54.48,10.29 55.41,9.36 | 55.41,9.36 v55.88,8.89 | 56.35,9.36 55.84,9.32 v55.88,8.89 | 56.35,9.36 56.31,8.86 v55.88,8.89 | 55.41,9.36 55.45,8.86 v55.88,8.89 | 55.41,9.36 55.91,9.32 v55.88,8.89 | 18.26,26.16 | 18.26,26.16 18.65,25.84 | v18.92,26.16 18.65,25.84 | 18.26,26.16 18.65,26.49 | 18.65,26.49 v18.92,26.16 | 18.26,26.16 18.65,25.84 | v18.92,26.16 18.65,25.84 | 18.26,26.16 18.65,26.49 | v18.92,26.16 18.65,26.49 | 18.26,26.16 18.65,25.84 | v18.92,26.16 18.65,25.84 | 18.26,26.16 18.65,26.49 | v18.92,26.16 18.65,26.49 | 31.26,26.49 31.65,26.16 | v30.99,26.16 31.26,26.49 | 31.65,26.16 | 31.26,25.84 31.65,26.16 | v30.99,26.16 31.26,25.84 | 31.65,26.16 31.26,26.49 | v30.99,26.16 31.26,26.49 | 31.65,26.16 31.26,25.84 | v30.99,26.16 31.26,25.84 | 31.26,26.49 31.65,26.16 | v30.99,26.16 31.26,26.49 | 31.26,25.84 31.65,26.16 | v30.99,26.16 31.26,25.84 | 51.11,8.83 51.29,8.36 v51.69,8.51 | 51.11,8.83 51.61,8.93 v51.69,8.51 | 53.74,10.61 54.13,10.29 | v53.47,10.29 53.74,10.61 | 54.13,10.29 | 53.74,9.96 54.13,10.29 | v53.47,10.29 53.74,9.96 | 54.13,10.29 53.74,10.61 | v53.47,10.29 53.74,10.61 | 54.13,10.29 53.74,9.96 | v53.47,10.29 53.74,9.96 | 53.74,10.61 54.13,10.29 | v53.47,10.29 53.74,10.61 | 53.74,9.96 54.13,10.29 | v53.47,10.29 53.74,9.96
  Top 0.508: 9.5,27.33 9.57,27.85 J4.4 8.98,27.26 9.5,27.33
  Bottom 0.254: R7.1 75.91,1.87 75.31,1.27 72.14,1.27 71.12,2.29 71.12,9.14 70.1,10.16 66.9,10.16 J1.4 65.43,9.55 64.77,8.89 56.54,8.89 | v55.88,8.89 56.54,8.89 | 56.54,8.89 | v18.92,26.16 19.58,26.16 | 19.58,26.16 | 19.58,26.16 30.33,26.16 | 30.33,26.16 | 30.33,26.16 v30.99,26.16 | v51.69,8.51 52.16,8.98 | 52.16,8.98 53,9.82 | 53,9.82 v53.47,10.29 | 56.16,9.22 56.54,8.89 | v55.88,8.89 56.16,9.22 | 56.54,8.89 | 56.16,8.56 56.54,8.89 | v55.88,8.89 56.16,8.56 | 56.54,8.89 56.16,9.22 | v55.88,8.89 56.16,9.22 | 56.54,8.89 56.16,8.56 | v55.88,8.89 56.16,8.56 | 56.16,9.22 56.54,8.89 | v55.88,8.89 56.16,9.22 | 56.16,8.56 56.54,8.89 | v55.88,8.89 56.16,8.56 | 19.2,26.49 19.58,26.16 | v18.92,26.16 19.2,26.49 | 19.58,26.16 | 19.2,25.84 19.58,26.16 | v18.92,26.16 19.2,25.84 | 19.58,26.16 19.2,26.49 | v18.92,26.16 19.2,26.49 | 19.58,26.16 19.2,25.84 | v18.92,26.16 19.2,25.84 | 19.2,26.49 19.58,26.16 | v18.92,26.16 19.2,26.49 | 19.2,25.84 19.58,26.16 | v18.92,26.16 19.2,25.84 | 30.33,26.16 | 30.33,26.16 30.71,25.84 | v30.99,26.16 30.71,25.84 | 30.33,26.16 30.71,26.49 | 30.71,26.49 v30.99,26.16 | 30.33,26.16 30.71,25.84 | v30.99,26.16 30.71,25.84 | 30.33,26.16 30.71,26.49 | v30.99,26.16 30.71,26.49 | 30.33,26.16 30.71,25.84 | v30.99,26.16 30.71,25.84 | 30.33,26.16 30.71,26.49 | v30.99,26.16 30.71,26.49 | 52.16,8.98 51.65,8.93 v51.69,8.51 | 52.16,8.98 52.11,8.47 v51.69,8.51 | 53,9.82 53.5,9.86 v53.47,10.29 | 53,9.82 53.04,10.32 v53.47,10.29
  Bottom 0.508: 66.9,10.16 | 66.58,10.58 66.9,10.16 | 66.58,10.58 | 66.9,10.16 | 66.9,10.16 66.58,9.74 | 66.58,9.74 | 66.58,10.58 66.9,10.16 | 66.58,10.58 | J1.4 66.58,10.58 | 66.58,9.74 66.9,10.16 | J1.4 66.58,9.74 | 66.58,10.58 66.9,10.16 | J1.4 66.58,10.58 | 66.58,9.74 66.9,10.16 | J1.4 66.58,9.74 | J1.4 65.95,9.48 65.43,9.55 65.36,10.07 J1.4
GND  (via drill 0.6, 0.8, 1.4)
  Top 0.254: 77.94,32.64 76.71,32.64 | 77.94,32.64 C10.2 | 77.94,32.64 81.26,32.64 IC4.3 | 76.71,32.64 C4.C | C11.2 75.82,31.75 76.71,32.64 | C7.2 C8.2 73.55,51.85 IC5.1 | C6.C 83.56,54.35 82.68,53.47 82.68,52.74 C9.2 | LED2.C 75.82,3.31 75.82,3.94 75.44,4.32 73.66,4.32 73.15,3.81 73.05,3.81 | v72.39,3.81 73.05,3.81 | 73.05,3.81 | R9.2 84.24,23.75 84.1,23.75 | v83.44,23.75 84.1,23.75 | 84.1,23.75 | v69.98,3.05 70.64,3.05 | 70.64,3.05 | 70.64,3.05 71.63,3.05 71.92,3.34 | 71.92,3.34 v72.39,3.81 | 66.27,16.26 64.01,16.26 63.97,16.3 | 66.27,16.26 | 66.27,16.26 v66.93,16.26 | v63.5,16.76 63.97,16.3 | 90.68,19.88 IC2.1 | 38.12,39.12 40.13,39.12 40.17,39.08 | 38.12,39.12 | 38.12,39.12 v37.47,39.12 | v40.64,38.61 40.17,39.08 | 48.55,48.85 47.62,49.78 47.62,51.41 | 48.55,48.85 v49.02,48.39 | v47.62,52.07 47.62,51.41 | 47.62,51.41 | v51.05,33.15 51.71,33.15 | 51.71,33.15 51.82,33.15 56.3,28.66 | 56.3,28.66 v56.77,28.19 | 72.67,4.14 73.05,3.81 | v72.39,3.81 72.67,4.14 | 73.05,3.81 | 72.67,3.48 73.05,3.81 | v72.39,3.81 72.67,3.48 | 73.05,3.81 72.67,4.14 | v72.39,3.81 72.67,4.14 | 73.05,3.81 72.67,3.48 | v72.39,3.81 72.67,3.48 | 72.67,4.14 73.05,3.81 | v72.39,3.81 72.67,4.14 | 72.67,3.48 73.05,3.81 | v72.39,3.81 72.67,3.48 | 71.92,3.34 72.42,3.38 v72.39,3.81 | 71.92,3.34 71.96,3.85 v72.39,3.81 | 83.72,24.07 84.1,23.75 | v83.44,23.75 83.72,24.07 | 84.1,23.75 | 83.72,23.42 84.1,23.75 | v83.44,23.75 83.72,23.42 | 84.1,23.75 83.72,24.07 | v83.44,23.75 83.72,24.07 | 84.1,23.75 83.72,23.42 | v83.44,23.75 83.72,23.42 | 83.72,24.07 84.1,23.75 | v83.44,23.75 83.72,24.07 | 83.72,23.42 84.1,23.75 | v83.44,23.75 83.72,23.42 | 70.25,3.37 70.64,3.05 | v69.98,3.05 70.25,3.37 | 70.64,3.05 | 70.25,2.72 70.64,3.05
  Top 0.254: v69.98,3.05 70.25,2.72 | 70.64,3.05 70.25,3.37 v69.98,3.05 | 70.64,3.05 70.25,2.72 | v69.98,3.05 70.25,2.72 | 70.25,3.37 70.64,3.05 | v69.98,3.05 70.25,3.37 | 70.25,2.72 70.64,3.05 | v69.98,3.05 70.25,2.72 | 66.27,16.26 | 66.27,16.26 66.65,15.93 | v66.93,16.26 66.65,15.93 | 66.27,16.26 66.65,16.58 | 66.65,16.58 v66.93,16.26 | 66.27,16.26 66.65,15.93 | v66.93,16.26 66.65,15.93 | 66.27,16.26 66.65,16.58 | v66.93,16.26 66.65,16.58 | 66.27,16.26 66.65,15.93 | v66.93,16.26 66.65,15.93 | 66.27,16.26 66.65,16.58 v66.93,16.26 | 63.97,16.3 63.92,16.8 v63.5,16.76 | 63.97,16.3 63.47,16.34 v63.5,16.76 | 38.12,39.12 37.74,39.44 | 37.74,39.44 v37.47,39.12 | 38.12,39.12 | 38.12,39.12 37.74,38.79 | 37.74,38.79 v37.47,39.12 | 38.12,39.12 37.74,39.44 v37.47,39.12 | 38.12,39.12 37.74,38.79 | v37.47,39.12 37.74,38.79 | 38.12,39.12 37.74,39.44 | 37.74,39.44 v37.47,39.12 | 38.12,39.12 37.74,38.79 | 37.74,38.79 v37.47,39.12 | 48.55,48.85 48.6,48.35 v49.02,48.39 | 48.55,48.85 49.06,48.81 v49.02,48.39 | 56.3,28.66 56.34,28.16 v56.77,28.19 | 56.3,28.66 56.8,28.62 v56.77,28.19 | 40.17,39.08 40.21,38.57 v40.64,38.61 | 40.17,39.08 40.67,39.03 v40.64,38.61 | 47.95,51.79 47.62,51.41 | v47.62,52.07 47.95,51.79 | 47.62,51.41 | 47.3,51.79 47.62,51.41 | v47.62,52.07 47.3,51.79 | 47.62,51.41 47.95,51.79 v47.62,52.07 | 47.62,51.41 47.3,51.79 | v47.62,52.07 47.3,51.79 | 47.95,51.79 47.62,51.41 | v47.62,52.07 47.95,51.79 | 47.3,51.79 47.62,51.41 | v47.62,52.07 47.3,51.79 | 51.71,33.15 51.33,33.47 v51.05,33.15 | 51.71,33.15 51.33,32.82 v51.05,33.15
  Top 0.406: JHALL.3 79.35,64.77 JULTRA.1 82.95,62.84 JPYRO.3 | v89.53,3.43 88.88,3.43 | 88.88,3.43 | 88.88,3.43 LED1.C | 90.68,19.88 90.92,19.88 90.92,20.45 | 88.88,3.43 | 88.88,3.43 89.35,3.13 v89.53,3.43 | 88.88,3.43 89.35,3.73 v89.53,3.43 | 89.35,3.13 88.88,3.43 | 89.35,3.73 88.88,3.43 | 88.88,3.43 89.35,3.13 | v89.53,3.43 89.35,3.13 | 88.88,3.43 89.35,3.73 | v89.53,3.43 89.35,3.73
  Top 0.61: IC5.1 72.42,46.23 v72.39,46.23 | C9.2 81.79,51.65 81.79,45.97 81.28,45.47 73.15,45.47 v72.39,46.23 | v72.39,46.23 72.26,46.35
  Top 0.813: IC1.1 78.93,19.56 79.12,19.56 | C1.- 93.03,36.77 97.54,41.27 97.54,51.05 96.52,52.07 JCAM.12 96.27,52.07 97.54,53.34 97.54,63.75 96.52,64.77 JCAM.2 | 79.35,64.77 78.82,65.19 JHALL.3 78.82,64.35 79.35,64.77 | 82.95,62.84 83.04,62.17 JPYRO.3 83.63,62.76 82.95,62.84
  Top 1.27: v80.64,19.56 79.12,19.56
  Top 1.778: 90.68,20.57 90.73,20.63 90.92,20.45 96.01,20.45 96.19,20.63 BATT.2
  Bottom 0.254: v72.39,3.81 71.92,4.28 | 71.92,4.28 71.63,4.57 71.63,8.51 74.21,11.09 D1.A 75.78,11.38 | v83.44,23.75 83.31,23.75 | R5.1 69.94,3.71 | 69.94,3.71 69.94,3.09 v69.98,3.05 | 63.5,15.24 R10.2 63.5,15.33 63.5,16.1 | 63.5,16.1 | 63.5,16.1 v63.5,16.76 | 66.97,15.6 66.97,16.22 v66.93,16.26 | 66.97,15.6 R6.1 | 40.64,37.95 40.64,35.81 39.33,34.5 | 40.64,37.95 | 40.64,37.95 v40.64,38.61 | v38.86,34.04 39.33,34.5 | J2.6 39.98,62.89 40.64,62.23 40.64,59.59 | 40.64,59.59 | 40.64,59.59 v40.64,58.93 | v47.62,52.07 47.5,52.2 46.98,52.2 | v43.43,52.2 44.09,52.2 | 44.09,52.2 | 44.09,52.2 46.98,52.2 | v49.28,28.57 49.28,29.23 | 49.28,29.23 49.28,31.37 50.59,32.68 | 50.59,32.68 v51.05,33.15 | 71.92,4.28 71.96,3.77 v72.39,3.81 | 71.92,4.28 72.42,4.24 v72.39,3.81 | 69.94,3.71 69.64,3.3 v69.98,3.05 | 69.94,3.71 70.29,3.34 v69.98,3.05 | 66.97,15.6 67.27,16 v66.93,16.26 | 66.97,15.6 66.62,15.96 v66.93,16.26 | 63.5,16.1 63.83,16.49 | 63.83,16.49 v63.5,16.76 | 63.5,16.1 | 63.5,16.1 63.17,16.49 | 63.17,16.49 v63.5,16.76 | 63.5,16.1 63.83,16.49 v63.5,16.76 | 63.5,16.1 63.17,16.49 | v63.5,16.76 63.17,16.49 | 63.5,16.1 63.83,16.49 | 63.83,16.49 v63.5,16.76 | 63.5,16.1 63.17,16.49 | 63.17,16.49 v63.5,16.76 | 40.64,59.59 | 40.31,59.2 40.64,59.59 | v40.64,58.93 40.31,59.2 | 40.97,59.2 40.64,59.59 | v40.64,58.93 40.97,59.2 | 40.31,59.2 40.64,59.59 | v40.64,58.93 40.31,59.2 | 40.97,59.2 40.64,59.59 | v40.64,58.93 40.97,59.2 | 40.31,59.2 40.64,59.59 | 40.31,59.2 v40.64,58.93 | 40.64,59.59 40.97,59.2 v40.64,58.93 | 43.71,52.52 44.09,52.2 | v43.43,52.2 43.71,52.52 | 44.09,52.2 | 43.71,51.87 44.09,52.2 | v43.43,52.2 43.71,51.87 | 44.09,52.2 43.71,52.52 | v43.43,52.2 43.71,52.52 | 44.09,52.2 43.71,51.87
  Bottom 0.254: v43.43,52.2 43.71,51.87 | 43.71,52.52 44.09,52.2 | v43.43,52.2 43.71,52.52 | 43.71,51.87 44.09,52.2 | v43.43,52.2 43.71,51.87 | 39.33,34.5 38.83,34.46 v38.86,34.04 | 39.33,34.5 39.29,34 v38.86,34.04 | 40.64,37.95 40.97,38.33 | 40.97,38.33 v40.64,38.61 | 40.64,37.95 | 40.64,37.95 40.31,38.33 | 40.31,38.33 v40.64,38.61 | 40.64,37.95 40.97,38.33 v40.64,38.61 | 40.64,37.95 40.31,38.33 | v40.64,38.61 40.31,38.33 | 40.64,37.95 40.97,38.33 | 40.97,38.33 v40.64,38.61 | 40.64,37.95 40.31,38.33 | 40.31,38.33 v40.64,38.61 | 49.28,29.23 48.95,28.85 v49.28,28.57 | 49.28,29.23 49.6,28.85 v49.28,28.57 | 46.98,52.2 47.29,51.8 v47.62,52.07 | 46.98,52.2 47.42,52.44 v47.62,52.07 | 50.59,32.68 51.09,32.72 v51.05,33.15 | 50.59,32.68 50.63,33.18 v51.05,33.15
  Bottom 0.406: 92.42,20.53 D3.A 91.78,15.24 D2.A 87.59,11.05 85.6,11.05 84.45,9.91 84.45,5.21 84.96,4.7 89.53,4.7 89.92,4.32 89.92,3.97 | v89.53,3.43 89.92,3.81 89.92,3.97 | 89.92,3.97 89.4,3.75 v89.53,3.43 | 89.92,3.97 89.89,3.41 v89.53,3.43
  Bottom 0.508: 39.98,62.89 40.05,63.41 J2.6 39.46,62.82 39.98,62.89
  Bottom 0.61: v72.39,46.23 72.39,36.45 76.58,32.26 IC4.3 | 92.42,20.53 92.84,20.95
  Bottom 1.016: 93,32.13 C1.- 92.9,32.26 IC4.3
  Bottom 1.27: v80.64,19.56 82.04,20.95 92.84,20.95 93.85,20.95
  Bottom 1.778: C1.- 93.03,21.78 93.85,20.95 96.19,20.95 BATT.2
  other vias: 68.71,56.26 17.78,49.53 17.78,46.99 13.46,36.83 26.04,47.24 8,14.48 73.66,22.99 29.21,9.14 39.37,7.62 25.91,30.35 26.42,56.26 41.78,26.67 52.7,55.5 3.3,7.24 19.94,34.04 55.88,19.3 32.26,29.84 39.12,29.97 16.38,57.28 18.41,57.28 14.35,57.28 3.3,62.99 3.17,43.18 3.17,41.15 11.3,2.29 17.02,2.29 52.07,4.45 67.94,32.13 67.94,28.83 96.39,37.59 78.87,62.1 70.87,48.77 32.89,47.5 20.7,39.75 89.92,54.36 88.39,56.9 36.96,15.88 45.47,16.13 6.35,52.58 59.18,48.9
  pour Top (isolate 0.406): 0,66.04 0,2.54 arc90 2.54,0 96.52,0 arc90 99.06,2.54 99.06,66.04 arc90 96.52,68.58 2.54,68.58 arc90
  pour Bottom (isolate 0.406): 0,66.04 0,2.54 arc90 2.54,0 96.52,0 arc90 99.06,2.54 99.06,66.04 arc90 96.52,68.58 2.54,68.58 arc90
GPLED0
  Top 0.254: LED3.C 3.68,57.28 6.35,54.61 10.16,54.61 10.82,55.27 J3.15
  Top 0.508: 10.82,55.27 11.34,55.2 J3.15 10.75,55.79 10.82,55.27
GPLED1
  Top 0.254: LED4.C 8.19,53.85 8.38,53.85 J4.14
  Top 0.508: 8.19,53.85 8.2,53.32 J4.14 8.7,54 8.19,53.85
GPLED2
  Top 0.254: J3.14 10.82,52.73 10.16,52.07 7.62,52.07 5.97,50.42 LED5.C
  Top 0.508: 10.82,52.73 11.34,52.66 J3.14 10.75,53.25 10.82,52.73
GPLED3
  Top 0.254: 8.37,50.8 J4.13 8.03,50.8 7.1,50.8 LED6.C
  Top 0.508: 8.03,50.8 8.35,50.38 J4.13 8.35,51.22 8.03,50.8
GPS_BOOT  (via drill 0.6)
  Top 0.254: J3.3 12.29,25.4 17.78,25.4 18.46,24.72 | 18.46,24.72 v18.92,24.26 | v21.46,16.13 22.12,16.13 | 22.12,16.13 | 22.12,16.13 34.42,16.13 40.51,10.03 44.58,10.03 45.72,8.89 45.72,6.35 48.26,6.35 48.92,5.69 JGPS.9 | 18.46,24.72 18.5,24.22 v18.92,24.26 | 18.46,24.72 18.96,24.68 v18.92,24.26 | 21.74,16.45 22.12,16.13 | v21.46,16.13 21.74,16.45 | 22.12,16.13 | 21.74,15.8 22.12,16.13 | v21.46,16.13 21.74,15.8 | 22.12,16.13 21.74,16.45 v21.46,16.13 | 22.12,16.13 21.74,15.8 | v21.46,16.13 21.74,15.8 | 21.74,16.45 22.12,16.13 | v21.46,16.13 21.74,16.45 | 21.74,15.8 22.12,16.13 | v21.46,16.13 21.74,15.8
  Top 0.508: 48.92,5.69 48.85,5.17 JGPS.9 49.44,5.76 48.92,5.69 | 12.29,25.4 11.97,25.82 J3.3 11.97,24.98 12.29,25.4
  Bottom 0.254: v18.92,24.26 18.46,23.79 | 18.46,23.79 18.29,23.62 18.29,22.86 17.14,21.72 17.14,20.19 17.65,19.68 17.65,19.05 19.94,16.76 20.57,16.76 20.8,16.54 | 20.8,16.54 20.9,16.48 | 20.9,16.48 21.08,16.38 v21.46,16.13 | 20.8,16.54 20.87,16.41 | 20.87,16.41 21.13,15.88 v21.46,16.13 | 20.8,16.54 21.52,16.54 v21.46,16.13 | 18.46,23.79 18.96,23.83 v18.92,24.26 | 18.46,23.79 18.5,24.29 v18.92,24.26 | 20.9,16.48 21.06,16 v21.46,16.13 | 20.9,16.48 21.4,16.55 v21.46,16.13 | 20.87,16.41 21.07,15.95 v21.46,16.13 | 20.87,16.41 21.35,16.54 v21.46,16.13 | v21.46,16.13 21.05,16.04 20.94,16.54 21.45,16.56 v21.46,16.13
GPS_EN  (via drill 0.6)
  Top 0.254: J4.3 9.5,24.79 10.16,24.13 16.74,24.13 | 16.74,24.13 | 16.74,24.13 v17.4,24.13 | v22.48,14.86 23.14,14.86 | 23.14,14.86 | 23.14,14.86 26.04,14.86 27.94,12.95 27.94,6.35 28.6,5.69 JGPS.1 | 16.74,24.13 | 16.74,24.13 17.12,23.8 | v17.4,24.13 17.12,23.8 | 16.74,24.13 17.12,24.46 | 17.12,24.46 v17.4,24.13 | 16.74,24.13 17.12,23.8 | v17.4,24.13 17.12,23.8 | 16.74,24.13 17.12,24.46 | v17.4,24.13 17.12,24.46 | 16.74,24.13 17.12,23.8 | v17.4,24.13 17.12,23.8 | 16.74,24.13 17.12,24.46 | v17.4,24.13 17.12,24.46 | 22.75,15.18 23.14,14.86 | v22.48,14.86 22.75,15.18 | 23.14,14.86 | 22.75,14.53 23.14,14.86 | v22.48,14.86 22.75,14.53 | 23.14,14.86 22.75,15.19 v22.48,14.86 | 23.14,14.86 22.75,14.53 | v22.48,14.86 22.75,14.53 | 22.75,15.18 23.14,14.86 | v22.48,14.86 22.75,15.18 | 22.75,14.53 23.14,14.86 | v22.48,14.86 22.75,14.53
  Top 0.508: 28.6,5.69 28.53,5.17 JGPS.1 29.12,5.76 28.6,5.69 | 9.5,24.79 9.57,25.31 J4.3 8.98,24.72 9.5,24.79
  Bottom 0.254: v17.4,24.13 16.93,23.66 | 21.82,14.86 | 21.82,14.86 v22.48,14.86 | 21.82,14.86 21.08,14.86 17.14,18.8 17.14,19.43 16.64,19.94 16.64,23.37 16.93,23.66 | 16.93,23.66 17.43,23.7 v17.4,24.13 | 16.93,23.66 16.97,24.16 v17.4,24.13 | 21.82,14.86 | 21.82,14.86 22.2,14.53 | v22.48,14.86 22.2,14.53 | 21.82,14.86 22.2,15.18 | 22.2,15.18 v22.48,14.86 | 21.82,14.86 22.2,14.53 | v22.48,14.86 22.2,14.53 | 21.82,14.86 22.2,15.18 | v22.48,14.86 22.2,15.18 | 21.82,14.86 22.2,14.53 | v22.48,14.86 22.2,14.53 | 21.82,14.86 22.2,15.19 v22.48,14.86
GPS_RX_I  (via drill 0.6)
  Top 0.254: J4.2 9.5,22.25 10.16,21.59 16.23,21.59 18.01,19.81 | v18.67,19.68 18.02,19.81 | 18.02,19.81 18.01,19.81 | v27.43,3.3 28.09,3.3 | 28.09,3.3 | 28.09,3.3 41.4,3.3 41.91,3.81 41.91,4.22 JGPS.6 | 18.02,19.8 18.01,19.81 | 18.02,19.8 18.52,19.36 v18.67,19.68 | 18.02,19.82 18.01,19.81 | 18.02,19.82 18.65,20.01 v18.67,19.68 | 18.02,19.81 18.33,19.42 | 18.33,19.42 18.34,19.42 v18.67,19.68 | 18.02,19.81 18.45,20.05 | 18.45,20.05 18.46,20.06 v18.67,19.68 | 18.02,19.8 18.34,19.41 v18.67,19.68 | 18.45,20.05 18.02,19.8 | v18.67,19.68 18.45,20.05 | 18.33,19.42 18.02,19.82 | v18.67,19.68 18.33,19.42 | 18.02,19.82 18.46,20.06 v18.67,19.68 | 27.71,3.63 28.09,3.3 | v27.43,3.3 27.71,3.63 | 28.09,3.3 | 27.71,2.98 28.09,3.3 | v27.43,3.3 27.71,2.98 | 28.09,3.3 27.71,3.63 v27.43,3.3 | 28.09,3.3 27.71,2.98 | v27.43,3.3 27.71,2.98 | 27.71,3.63 28.09,3.3 | v27.43,3.3 27.71,3.63 | 27.71,2.98 28.09,3.3 | v27.43,3.3 27.71,2.98
  Top 0.508: 41.91,4.22 42.33,4.54 | 42.33,4.54 | 41.91,4.22 41.49,4.54 | 41.49,4.54 | 42.33,4.54 41.91,4.22 | 42.33,4.54 | JGPS.6 42.33,4.54 | 41.49,4.54 41.91,4.22 | JGPS.6 41.49,4.54 | 42.33,4.54 41.91,4.22 | JGPS.6 42.33,4.54 | 41.49,4.54 41.91,4.22 | JGPS.6 41.49,4.54 | 9.5,22.25 9.57,22.77 J4.2 8.98,22.18 9.5,22.25
  Bottom 0.254: 18.54,19.02 v18.67,19.68 | v27.43,3.3 27.43,3.96 | 27.43,3.96 | 27.43,3.96 27.43,13.46 26.16,14.73 24.26,14.73 21.72,17.27 20.19,17.27 18.54,18.92 18.54,19.02 | 18.54,19.02 18.99,19.41 v18.67,19.68 | 18.54,19.02 18.34,19.54 v18.67,19.68 | 18.93,19.35 18.54,19.04 18.3,19.48 v18.67,19.68 | 18.93,19.35 18.94,19.35 v18.67,19.68 | v18.67,19.68 18.94,19.36 18.55,19.04 18.3,19.47 v18.67,19.68 | 18.93,19.35 18.54,19.04 18.3,19.48 v18.67,19.68 | v18.67,19.68 18.93,19.35 | 27.43,3.96 | 27.11,3.58 27.43,3.96 | v27.43,3.3 27.11,3.58 | 27.76,3.58 27.43,3.96 | v27.43,3.3 27.76,3.58 | 27.11,3.58 27.43,3.96 | v27.43,3.3 27.11,3.58 | 27.76,3.58 27.43,3.96 | v27.43,3.3 27.76,3.58 | 27.43,3.96 27.11,3.58 | v27.43,3.3 27.11,3.58 | 27.43,3.96 27.76,3.58 | v27.43,3.3 27.76,3.58
GPS_TX_O  (via drill 0.6)
  Top 0.254: J3.2 12.29,22.86 17.27,22.86 18.2,21.93 | 18.2,21.93 v18.67,21.46 | v36.83,11.05 36.83,10.39 | 36.83,10.39 | 36.83,10.39 36.83,5.94 JGPS.4 | 18.2,21.93 18.24,21.43 v18.67,21.46 | 18.2,21.93 18.7,21.89 v18.67,21.46 | 37.16,10.77 36.83,10.39 | v36.83,11.05 37.16,10.77 | 36.83,10.39 | 36.5,10.77 36.83,10.39 | v36.83,11.05 36.5,10.77 | 36.83,10.39 37.16,10.77 | v36.83,11.05 37.16,10.77 | 36.83,10.39 36.5,10.77 | v36.83,11.05 36.5,10.77 | 37.16,10.77 36.83,10.39 | v36.83,11.05 37.16,10.77 | 36.5,10.77 36.83,10.39 | v36.83,11.05 36.5,10.77
  Top 0.508: 36.83,5.94 | 36.83,5.94 36.41,5.62 | 36.41,5.62 | 36.83,5.94 | 36.83,5.94 37.25,5.62 | 37.25,5.62 | 36.83,5.94 36.41,5.62 | 36.41,5.62 | JGPS.4 36.41,5.62 | 36.83,5.94 37.25,5.62 | JGPS.4 37.25,5.62 | 36.83,5.94 36.41,5.62 | JGPS.4 36.41,5.62 | 36.83,5.94 37.25,5.62 | JGPS.4 37.25,5.62 | 12.29,22.86 11.97,23.28 J3.2 11.97,22.44 12.29,22.86
  Bottom 0.254: v18.67,21.46 19.05,20.93 | 36.36,11.52 32.64,15.24 24.51,15.24 21.97,17.78 20.45,17.78 19.68,18.54 19.68,20.07 19.18,20.57 19.18,20.8 19.05,20.93 | 36.36,11.52 v36.83,11.05 | 19.05,20.93 18.99,21.57 v18.67,21.46 | 19.05,20.93 18.47,21.19 v18.67,21.46 | 19.05,20.93 | 19.05,20.93 19.09,21.43 v18.67,21.46 | 19.05,20.93 18.57,21.05 v18.67,21.46 | 36.36,11.52 36.4,11.01 v36.83,11.05 | 36.36,11.52 36.87,11.47 v36.83,11.05
HALL_OUT  (via drill 0.6)
  Top 0.254: J3.12 12.29,48.26 21.97,48.26 27.56,53.85 27.56,55.12 28.17,55.73 | JHALL.2 75.95,64.64 75.4,64.1 72.01,60.71 51.94,60.71 47.5,56.26 42.7,56.26 | v42.04,56.26 42.7,56.26 | 42.7,56.26 | 28.17,55.73 v28.64,56.2 | 42.31,56.59 42.7,56.26 | v42.04,56.26 42.31,56.59 | 42.7,56.26 | 42.31,55.94 42.7,56.26 | v42.04,56.26 42.31,55.94 | 42.7,56.26 42.31,56.59 | v42.04,56.26 42.31,56.59 | 42.7,56.26 42.31,55.94 | v42.04,56.26 42.31,55.94 | 42.31,56.59 42.7,56.26 | v42.04,56.26 42.31,56.59 | 42.31,55.94 42.7,56.26 | v42.04,56.26 42.31,55.94 | 28.17,55.73 28.67,55.77 v28.64,56.2 | 28.17,55.73 28.21,56.23 v28.64,56.2
  Top 0.508: 75.4,64.1 75.93,64.08 | 75.4,64.1 75.28,64.61 | 75.93,64.08 75.4,64.1 | 75.93,64.08 | JHALL.2 75.93,64.08 | 75.28,64.61 75.4,64.1 | 75.28,64.61 JHALL.2 | 75.93,64.08 75.4,64.1 | 75.93,64.08 JHALL.2 | 75.4,64.1 75.28,64.61 | JHALL.2 75.28,64.61 | 12.29,48.26 11.97,48.68 J3.12 11.97,47.84 12.29,48.26
  Bottom 0.254: v42.04,56.26 41.97,56.2 41.38,56.2 | v28.64,56.2 29.3,56.2 | 29.3,56.2 | 29.3,56.2 41.38,56.2 | 41.38,56.2 41.79,55.91 v42.04,56.26 | 41.38,56.2 41.73,56.56 v42.04,56.26 | 28.91,56.52 29.3,56.2 | v28.64,56.2 28.91,56.52 | 29.3,56.2 | 28.91,55.87 29.3,56.2 | v28.64,56.2 28.91,55.87 | 29.3,56.2 28.91,56.52 | v28.64,56.2 28.91,56.52 | 29.3,56.2 28.91,55.87 | v28.64,56.2 28.91,55.87 | 28.91,56.52 29.3,56.2 | v28.64,56.2 28.91,56.52 | 28.91,55.87 29.3,56.2 | v28.64,56.2 28.91,55.87
M1  (via drill 0.6)
  Top 0.406: v80.9,3.56 81.37,3.09 | 81.37,3.09 81.66,2.79 81.66,1.52 | 81.37,3.09 81.24,3.63 v80.9,3.56 | 81.37,3.09 80.82,3.21 v80.9,3.56
  Top 0.813: IC1.8 IC1.4
  Top 1.778: MOTOR.1 91.69,1.52 81.66,1.52 80.14,1.52 78.74,2.92 78.74,5.71 75.19,9.27 IC1.8
  Bottom 0.406: 80.24,3.56 79.12,3.56 76.07,6.6 D1.C | 80.24,3.56 | 80.24,3.56 v80.9,3.56 | 80.24,3.56 | 80.24,3.56 80.71,3.26 v80.9,3.56 | 80.24,3.56 80.71,3.85 v80.9,3.56 | 80.24,3.56 80.71,3.26 | 80.24,3.56 80.71,3.85 | 80.24,3.56 80.71,3.26 | v80.9,3.56 80.71,3.26 | 80.24,3.56 80.71,3.85 | v80.9,3.56 80.71,3.85
M2
  Top 0.813: 86.94,9.85 86.36,10.44 IC2.4
  Top 1.778: IC2.8 86.94,9.85 MOTOR.2
  Bottom 0.406: 87.67,6.73 90.04,6.73 93.16,9.85 95.5,9.85 MOTOR.2
  Bottom 0.813: 95.5,9.85 96.16,9.36 MOTOR.2 96.16,10.34 95.5,9.85
  Bottom 1.778: D2.C 87.67,6.73
N$1  (via drill 0.6)
  Top 0.254: 79.34,23.11 79.34,23.03 v79.76,22.61 | 79.34,23.11 R1.2 | v87.63,22.48 87.63,21.82 | 87.63,21.82 | 87.63,21.82 IC2.3 | 79.34,23.11 79.33,22.61 v79.76,22.61 | 79.34,23.11 79.83,23.03 v79.76,22.61 | 87.96,22.2 87.63,21.82 | v87.63,22.48 87.96,22.2 | 87.63,21.82 | 87.3,22.2 87.63,21.82 | v87.63,22.48 87.3,22.2 | 87.63,21.82 87.96,22.2 | v87.63,22.48 87.96,22.2 | 87.63,21.82 87.3,22.2 | v87.63,22.48 87.3,22.2 | 87.96,22.2 87.63,21.82 | v87.63,22.48 87.96,22.2 | 87.3,22.2 87.63,21.82 | v87.63,22.48 87.3,22.2